# Altium schematic sheet Power.SchDoc
size A4
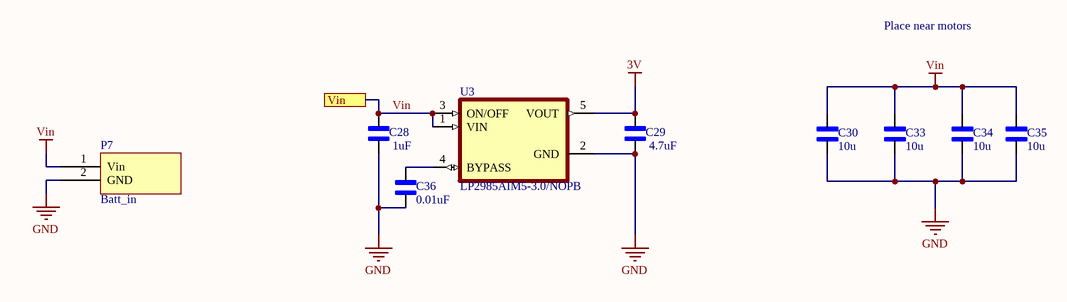
[diagram p0: Power.SchDoc]

## Parts
C28  1uF  [0402 Capacitor Generic]
C29  4.7uF  [0402 Capacitor Generic]
C30  10u  [0402 Capacitor Generic]
C33  10u  [0402 Capacitor Generic]
C34  10u  [0402 Capacitor Generic]
C35  10u  [0402 Capacitor Generic]
C36  0.01uF  [0402 Capacitor Generic]
P7  Batt_in  [2 Solder Pads]
U3  LP2985AIM5-3.0/NOPB  [SOT-23]

## Ports
Vin

## Nets
3V: C29.1 U3.5(VOUT)
GND: C28.2 C29.2 C30.2 C33.2 C34.2 C35.2 C36.1 P7.2(GND) U3.2(GND)
Vin: C28.1 C30.1 C33.1 C34.1 C35.1 P7.1(Vin) U3.1(VIN) U3.3(ON/OFF) ; port Vin
NetC36_2: C36.2 U3.4(BYPASS)

## Notes on the sheet
- Place near motors

## Library data of the parts
C28-C30 C33-C36 = 0402 Ceramic Capacitor: Generic 0402 Ceramic Capacitor; MP: AC0402FR-071ML; MF: Yageo; Package: 1005 Yageo; SnapEDA_Link: https://www.snapeda.com/parts/AC0402FR-071ML/Yageo/view-part/940461/?ref=snap; Value: *; Mouser-Purchase-URL: https://snapeda.com/shop?store=Mouser&id=940461; DigiKey-Purchase-URL: https://snapeda.com/shop?store=DigiKey&id=940461
U3 = LP2985AIM5-3.0/NOPB: Fixed 3V LDO (16V MAX) 150mA SOT-23-5 Linear Voltage Regulator